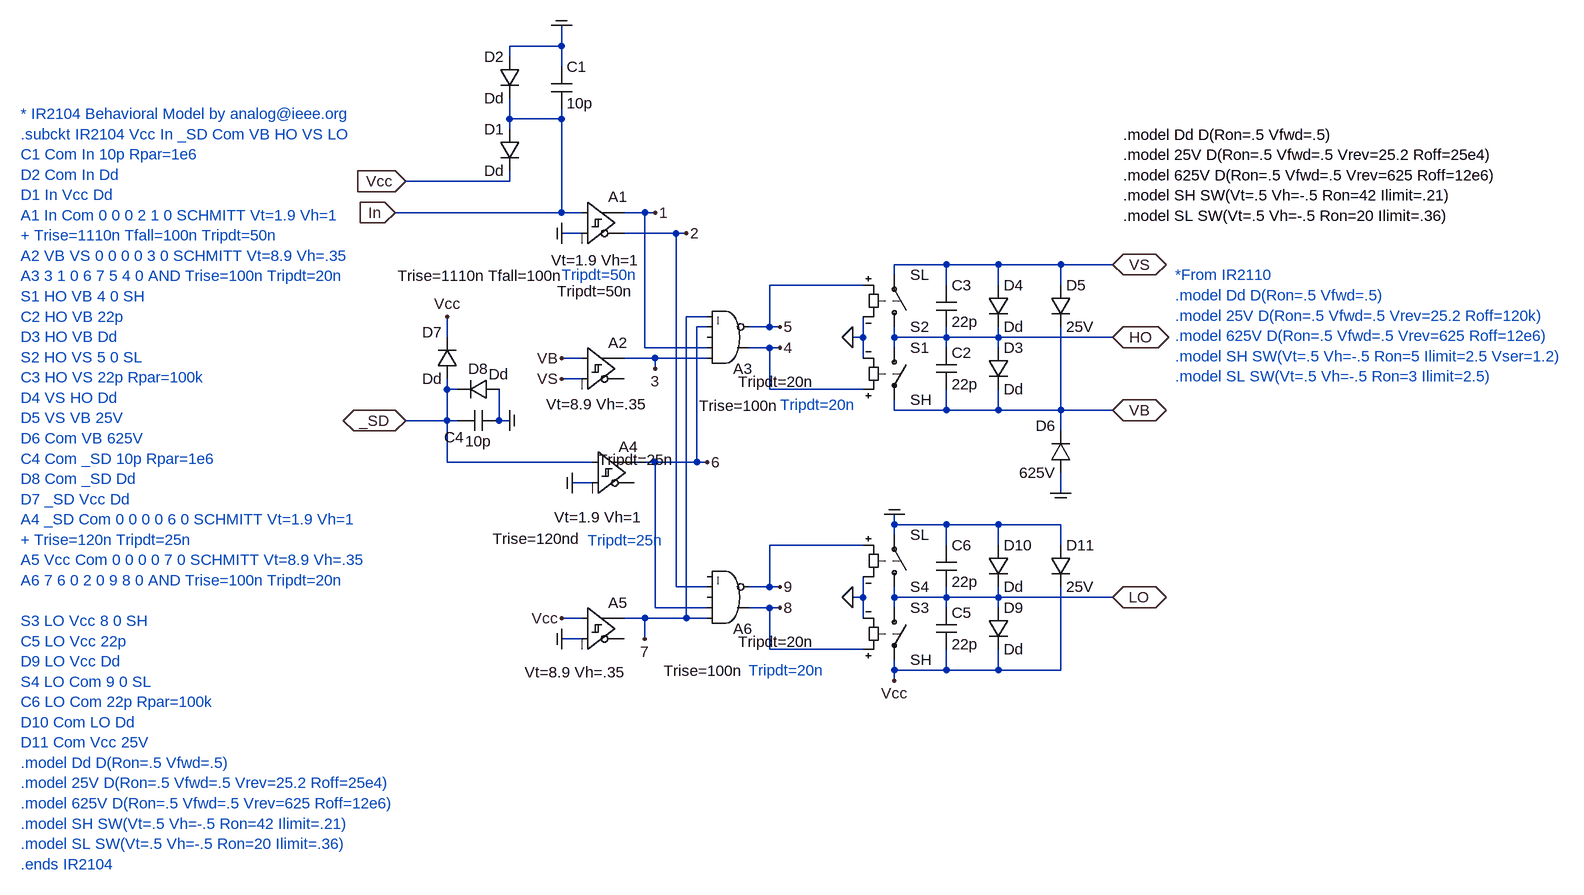
[diagram p0: schematic IR2104A.asc]
IR2104A.asc, the LTspice schematic file:
Version 4
SHEET 1 2180 1316
WIRE 560 -384 560 -416
WIRE 560 -384 480 -384
WIRE 480 -368 480 -384
WIRE 560 -352 560 -384
WIRE 480 -272 480 -304
WIRE 560 -272 560 -288
WIRE 560 -272 480 -272
WIRE 480 -256 480 -272
WIRE 480 -176 480 -192
WIRE 480 -176 320 -176
WIRE 560 -128 560 -272
WIRE 560 -128 304 -128
WIRE 592 -128 560 -128
WIRE 688 -128 656 -128
WIRE 704 -128 688 -128
WIRE 592 -96 560 -96
WIRE 736 -96 656 -96
WIRE 752 -96 736 -96
WIRE 1152 -48 1072 -48
WIRE 1232 -48 1152 -48
WIRE 1328 -48 1232 -48
WIRE 1408 -48 1328 -48
WIRE 1072 -32 1072 -48
WIRE 1024 -16 880 -16
WIRE 1152 -16 1152 -48
WIRE 1232 -16 1232 -48
WIRE 1328 -16 1328 -48
WIRE 784 32 752 32
WIRE 784 48 768 48
WIRE 880 48 880 -16
WIRE 880 48 848 48
WIRE 896 48 880 48
WIRE 384 64 384 32
WIRE 1024 64 1024 32
WIRE 1024 64 1008 64
WIRE 1072 64 1072 48
WIRE 1152 64 1152 48
WIRE 1152 64 1072 64
WIRE 1232 64 1232 48
WIRE 1232 64 1152 64
WIRE 1408 64 1232 64
WIRE 688 80 688 -128
WIRE 784 80 688 80
WIRE 880 80 848 80
WIRE 896 80 880 80
WIRE 1072 80 1072 64
WIRE 1152 80 1152 64
WIRE 1232 80 1232 64
WIRE 592 96 560 96
WIRE 704 96 656 96
WIRE 784 96 704 96
WIRE 1024 96 1024 64
WIRE 704 112 704 96
WIRE 592 128 560 128
WIRE 384 144 384 128
WIRE 400 144 384 144
WIRE 880 144 880 80
WIRE 1024 144 880 144
WIRE 1072 176 1072 160
WIRE 1152 176 1152 144
WIRE 1152 176 1072 176
WIRE 1232 176 1232 144
WIRE 1232 176 1152 176
WIRE 1328 176 1328 48
WIRE 1328 176 1232 176
WIRE 1408 176 1328 176
WIRE 384 192 384 144
WIRE 384 192 320 192
WIRE 400 192 384 192
WIRE 464 192 464 144
WIRE 480 192 464 192
WIRE 1328 208 1328 176
WIRE 384 256 384 192
WIRE 608 256 384 256
WIRE 704 256 672 256
WIRE 768 256 768 48
WIRE 768 256 704 256
WIRE 784 256 768 256
WIRE 608 288 576 288
WIRE 1328 304 1328 272
WIRE 1072 352 1072 336
WIRE 1152 352 1072 352
WIRE 1232 352 1152 352
WIRE 1328 352 1232 352
WIRE 1072 368 1072 352
WIRE 1024 384 880 384
WIRE 1152 384 1152 352
WIRE 1232 384 1232 352
WIRE 1328 384 1328 352
WIRE 736 448 736 -96
WIRE 784 448 736 448
WIRE 880 448 880 384
WIRE 880 448 848 448
WIRE 896 448 880 448
WIRE 1024 464 1024 432
WIRE 1024 464 1008 464
WIRE 1072 464 1072 448
WIRE 1152 464 1152 448
WIRE 1152 464 1072 464
WIRE 1232 464 1232 448
WIRE 1232 464 1152 464
WIRE 1408 464 1232 464
WIRE 704 480 704 256
WIRE 784 480 704 480
WIRE 880 480 848 480
WIRE 896 480 880 480
WIRE 1072 480 1072 464
WIRE 1152 480 1152 464
WIRE 1232 480 1232 464
WIRE 592 496 560 496
WIRE 688 496 656 496
WIRE 752 496 752 32
WIRE 752 496 688 496
WIRE 784 496 752 496
WIRE 1024 496 1024 464
WIRE 592 528 560 528
WIRE 688 528 688 496
WIRE 880 544 880 480
WIRE 1024 544 880 544
WIRE 1072 576 1072 560
WIRE 1152 576 1152 544
WIRE 1152 576 1072 576
WIRE 1232 576 1232 544
WIRE 1232 576 1152 576
WIRE 1328 576 1328 448
WIRE 1328 576 1232 576
WIRE 1072 592 1072 576
FLAG 560 -416 COM
IOPIN 560 -416 BiDir
FLAG 320 -176 Vcc
IOPIN 320 -176 In
FLAG 704 -128 1
FLAG 752 -96 2
FLAG 304 -128 In
IOPIN 304 -128 In
FLAG 560 -96 COM
FLAG 704 112 3
FLAG 560 96 VB
FLAG 560 128 VS
FLAG 896 80 4
FLAG 896 48 5
FLAG 1408 64 HO
IOPIN 1408 64 BiDir
FLAG 1408 176 VB
IOPIN 1408 176 BiDir
FLAG 1408 -48 VS
IOPIN 1408 -48 BiDir
FLAG 1328 304 COM
FLAG 480 192 COM
FLAG 320 192 _SD
IOPIN 320 192 BiDir
FLAG 384 32 Vcc
FLAG 784 256 6
FLAG 576 288 COM
FLAG 688 528 7
FLAG 560 496 Vcc
FLAG 560 528 com
FLAG 896 480 8
FLAG 896 448 9
FLAG 1408 464 LO
IOPIN 1408 464 BiDir
FLAG 1072 592 Vcc
FLAG 1072 336 com
FLAG 1008 64 0
FLAG 1008 464 0
SYMBOL cap 544 -288 M180
WINDOW 0 24 64 Left 0
WINDOW 3 24 8 Left 0
SYMATTR InstName C1
SYMATTR Value 10p
SYMATTR SpiceLine Rpar=1Meg
SYMBOL diode 496 -256 M0
SYMATTR InstName D1
SYMATTR Value Dd
SYMBOL diode 496 -368 M0
SYMATTR InstName D2
SYMATTR Value Dd
SYMBOL Digital\\and 816 128 M180
WINDOW 3 -44 -41 Left 0
WINDOW 123 16 -4 Left 0
SYMATTR Value Trise=100n
SYMATTR Value2 Tripdt=20n
SYMATTR InstName A3
SYMBOL Digital\\diffschmitt 592 -176 R0
WINDOW 3 -48 121 Left 0
WINDOW 123 -284 145 Left 0
WINDOW 39 -39 169 Left 0
SYMATTR Value Vt=1.9 Vh=1
SYMATTR Value2 Trise=1110n Tfall=100n
SYMATTR SpiceLine Tripdt=50n
SYMATTR InstName A1
SYMBOL Digital\\diffschmitt 592 48 R0
WINDOW 3 -56 119 Left 0
WINDOW 123 3 155 Left 0
SYMATTR Value Vt=8.9 Vh=.35
SYMATTR InstName A2
SYMBOL sw 1072 64 R0
SYMATTR InstName S1
SYMATTR Value SH
SYMBOL cap 1136 80 R0
SYMATTR InstName C2
SYMATTR Value 22p
SYMBOL diode 1216 80 R0
SYMATTR InstName D3
SYMATTR Value Dd
SYMBOL sw 1072 64 M180
SYMATTR InstName S2
SYMATTR Value SL
SYMBOL cap 1136 48 M180
WINDOW 0 24 64 Left 0
WINDOW 3 24 8 Left 0
SYMATTR InstName C3
SYMATTR Value 22p
SYMATTR SpiceLine Rpar=100k
SYMBOL diode 1216 -16 R0
SYMATTR InstName D4
SYMATTR Value Dd
SYMBOL diode 1312 -16 R0
SYMATTR InstName D5
SYMATTR Value 25V
SYMBOL diode 1344 272 R180
WINDOW 0 24 72 Left 0
WINDOW 3 24 0 Left 0
SYMATTR InstName D6
SYMATTR Value 625V
SYMBOL cap 400 208 R270
WINDOW 0 -25 -5 VTop 0
WINDOW 3 0 32 VBottom 0
SYMATTR InstName C4
SYMATTR Value 10p
SYMATTR SpiceLine Rpar=1Meg
SYMBOL diode 464 128 R90
WINDOW 0 0 32 VBottom 0
WINDOW 3 -23 1 VTop 0
SYMATTR InstName D8
SYMATTR Value Dd
SYMBOL diode 400 128 R180
WINDOW 0 24 72 Left 0
WINDOW 3 24 0 Left 0
SYMATTR InstName D7
SYMATTR Value Dd
SYMBOL Digital\\diffschmitt 608 208 R0
WINDOW 3 -59 133 Left 0
WINDOW 123 -154 166 Left 0
WINDOW 39 8 44 Left 0
SYMATTR Value Vt=1.9 Vh=1
SYMATTR Value2 Trise=120nd
SYMATTR SpiceLine Tripdt=25n
SYMATTR InstName A4
SYMBOL Digital\\diffschmitt 592 448 R0
WINDOW 3 -89 131 Left 0
WINDOW 123 3 155 Left 0
SYMATTR Value Vt=8.9 Vh=.35
SYMATTR InstName A5
SYMBOL Digital\\and 816 528 M180
WINDOW 3 -99 -49 Left 0
WINDOW 123 16 -4 Left 0
SYMATTR Value Trise=100n
SYMATTR Value2 Tripdt=20n
SYMATTR InstName A6
SYMBOL sw 1072 464 R0
SYMATTR InstName S3
SYMATTR Value SH
SYMBOL cap 1136 480 R0
SYMATTR InstName C5
SYMATTR Value 22p
SYMBOL diode 1216 480 R0
SYMATTR InstName D9
SYMATTR Value Dd
SYMBOL sw 1072 464 M180
SYMATTR InstName S4
SYMATTR Value SL
SYMBOL cap 1136 448 M180
WINDOW 0 24 64 Left 0
WINDOW 3 24 8 Left 0
SYMATTR InstName C6
SYMATTR Value 22p
SYMATTR SpiceLine Rpar=100k
SYMBOL diode 1216 384 R0
SYMATTR InstName D10
SYMATTR Value Dd
SYMBOL diode 1312 384 R0
SYMATTR InstName D11
SYMATTR Value 25V
TEXT -272 -280 Left 0 ;* IR2104 Behavioral Model by analog@ieee.org\n.subckt IR2104 Vcc In _SD Com VB HO VS LO\nC1 Com In 10p Rpar=1e6\nD2 Com In Dd\nD1 In Vcc Dd\nA1 In Com 0 0 0 2 1 0 SCHMITT Vt=1.9 Vh=1\n+ Trise=1110n Tfall=100n Tripdt=50n\nA2 VB VS 0 0 0 0 3 0 SCHMITT Vt=8.9 Vh=.35\nA3 3 1 0 6 7 5 4 0 AND Trise=100n Tripdt=20n\nS1 HO VB 4 0 SH\nC2 HO VB 22p\nD3 HO VB Dd\nS2 HO VS 5 0 SL\nC3 HO VS 22p Rpar=100k\nD4 VS HO Dd\nD5 VS VB 25V\nD6 Com VB 625V\nC4 Com _SD 10p Rpar=1e6\nD8 Com _SD Dd\nD7 _SD Vcc Dd\nA4 _SD Com 0 0 0 0 6 0 SCHMITT Vt=1.9 Vh=1\n+ Trise=120n Tripdt=25n\nA5 Vcc Com 0 0 0 0 7 0 SCHMITT Vt=8.9 Vh=.35\nA6 7 6 0 2 0 9 8 0 AND Trise=100n Tripdt=20n\n \nS3 LO Vcc 8 0 SH\nC5 LO Vcc 22p\nD9 LO Vcc Dd\nS4 LO Com 9 0 SL\nC6 LO Com 22p Rpar=100k\nD10 Com LO Dd\nD11 Com Vcc 25V\n.model Dd D(Ron=.5 Vfwd=.5)\n.model 25V D(Ron=.5 Vfwd=.5 Vrev=25.2 Roff=25e4)\n.model 625V D(Ron=.5 Vfwd=.5 Vrev=625 Roff=12e6)\n.model SH SW(Vt=.5 Vh=-.5 Ron=42 Ilimit=.21)\n.model SL SW(Vt=.5 Vh=-.5 Ron=20 Ilimit=.36)\n.ends IR2104
TEXT 1424 -248 Left 0 !.model Dd D(Ron=.5 Vfwd=.5)\n.model 25V D(Ron=.5 Vfwd=.5 Vrev=25.2 Roff=25e4)\n.model 625V D(Ron=.5 Vfwd=.5 Vrev=625 Roff=12e6)\n.model SH SW(Vt=.5 Vh=-.5 Ron=42 Ilimit=.21)\n.model SL SW(Vt=.5 Vh=-.5 Ron=20 Ilimit=.36)
TEXT 600 376 Left 0 ;Tripdt=25n
TEXT 848 576 Left 0 ;Tripdt=20n
TEXT 896 168 Left 0 ;Tripdt=20n
TEXT 560 -32 Left 0 ;Tripdt=50n
TEXT 1504 -32 Left 0 ;*From IR2110\n.model Dd D(Ron=.5 Vfwd=.5)\n.model 25V D(Ron=.5 Vfwd=.5 Vrev=25.2 Roff=120k)\n.model 625V D(Ron=.5 Vfwd=.5 Vrev=625 Roff=12e6)\n.model SH SW(Vt=.5 Vh=-.5 Ron=5 Ilimit=2.5 Vser=1.2)\n.model SL SW(Vt=.5 Vh=-.5 Ron=3 Ilimit=2.5)

The netlist it stands for:
* IR2104A.asc
C1 In COM 10p Rpar=1Meg
D1 In Vcc Dd
D2 COM In Dd
A3 3 1 0 6 7 5 4 0 AND Trise=100n Tripdt=20n
A1 In COM 0 0 0 2 1 0 SCHMITT Vt=1.9 Vh=1 Trise=1110n Tfall=100n Tripdt=50n
A2 VB VS 0 0 0 0 3 0 SCHMITT Vt=8.9 Vh=.35
S1 HO VB 4 0 SH
C2 HO VB 22p
D3 HO VB Dd
S2 HO VS 5 0 SL
C3 HO VS 22p Rpar=100k
D4 VS HO Dd
D5 VS VB 25V
D6 COM VB 625V
C4 _SD COM 10p Rpar=1Meg
D8 COM _SD Dd
D7 _SD Vcc Dd
A4 _SD COM 0 0 0 0 6 0 SCHMITT Vt=1.9 Vh=1 Trise=120nd Tripdt=25n
A5 Vcc COM 0 0 0 0 7 0 SCHMITT Vt=8.9 Vh=.35
A6 7 6 0 2 0 9 8 0 AND Trise=100n Tripdt=20n
S3 LO Vcc 8 0 SH
C5 LO Vcc 22p
D9 LO Vcc Dd
S4 LO COM 9 0 SL
C6 LO COM 22p Rpar=100k
D10 COM LO Dd
D11 COM Vcc 25V
.model D D
.lib standard.dio
* * IR2104 Behavioral Model by analog@ieee.org
* .subckt IR2104 Vcc In _SD Com VB HO VS LO
* C1 Com In 10p Rpar=1e6
* D2 Com In Dd
* D1 In Vcc Dd
* A1 In Com 0 0 0 2 1 0 SCHMITT Vt=1.9 Vh=1
* + Trise=1110n Tfall=100n Tripdt=50n
* A2 VB VS 0 0 0 0 3 0 SCHMITT Vt=8.9 Vh=.35
* A3 3 1 0 6 7 5 4 0 AND Trise=100n Tripdt=20n
* S1 HO VB 4 0 SH
* C2 HO VB 22p
* D3 HO VB Dd
* S2 HO VS 5 0 SL
* C3 HO VS 22p Rpar=100k
* D4 VS HO Dd
* D5 VS VB 25V
* D6 Com VB 625V
* C4 Com _SD 10p Rpar=1e6
* D8 Com _SD Dd
* D7 _SD Vcc Dd
* A4 _SD Com 0 0 0 0 6 0 SCHMITT Vt=1.9 Vh=1
* + Trise=120n Tripdt=25n
* A5 Vcc Com 0 0 0 0 7 0 SCHMITT Vt=8.9 Vh=.35
* A6 7 6 0 2 0 9 8 0 AND Trise=100n Tripdt=20n
* S3 LO Vcc 8 0 SH
* C5 LO Vcc 22p
* D9 LO Vcc Dd
* S4 LO Com 9 0 SL
* C6 LO Com 22p Rpar=100k
* D10 Com LO Dd
* D11 Com Vcc 25V
* .model Dd D(Ron=.5 Vfwd=.5)
* .model 25V D(Ron=.5 Vfwd=.5 Vrev=25.2 Roff=25e4)
* .model 625V D(Ron=.5 Vfwd=.5 Vrev=625 Roff=12e6)
* .model SH SW(Vt=.5 Vh=-.5 Ron=42 Ilimit=.21)
* .model SL SW(Vt=.5 Vh=-.5 Ron=20 Ilimit=.36)
* .ends IR2104
.model Dd D(Ron=.5 Vfwd=.5)
.model 25V D(Ron=.5 Vfwd=.5 Vrev=25.2 Roff=25e4)
.model 625V D(Ron=.5 Vfwd=.5 Vrev=625 Roff=12e6)
.model SH SW(Vt=.5 Vh=-.5 Ron=42 Ilimit=.21)
.model SL SW(Vt=.5 Vh=-.5 Ron=20 Ilimit=.36)
* Tripdt=25n
* Tripdt=20n
* Tripdt=20n
* Tripdt=50n
* *From IR2110
* .model Dd D(Ron=.5 Vfwd=.5)
* .model 25V D(Ron=.5 Vfwd=.5 Vrev=25.2 Roff=120k)
* .model 625V D(Ron=.5 Vfwd=.5 Vrev=625 Roff=12e6)
* .model SH SW(Vt=.5 Vh=-.5 Ron=5 Ilimit=2.5 Vser=1.2)
* .model SL SW(Vt=.5 Vh=-.5 Ron=3 Ilimit=2.5)
.backanno
.end